# Altium schematic sheet Main.SchDoc
size A4; Revision: V1.0; SheetNumber: 1; SheetTotal: 3
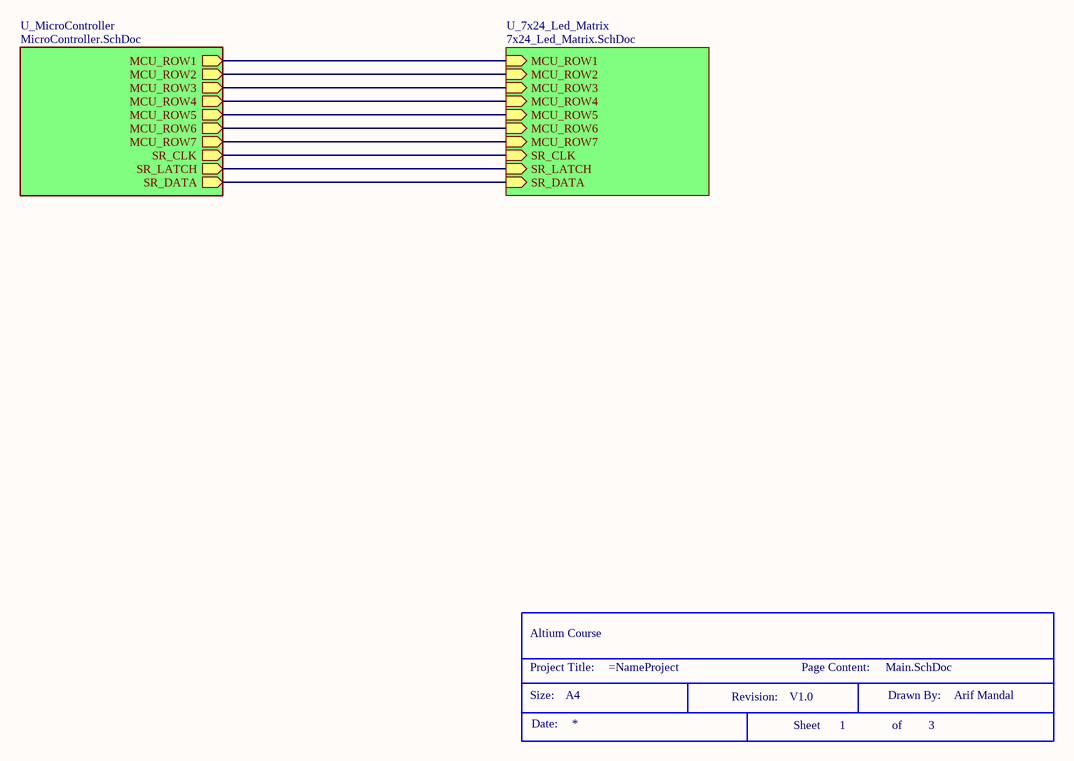
[diagram p0: Main.SchDoc]

## Parts
*  Size: A4  Drawn By: Arif Mandal  (hidden comment: Title Block)  (graphical)

## Sub-sheets
U_7x24_Led_Matrix = 7x24_Led_Matrix.SchDoc: MCU_ROW1 (in), MCU_ROW2 (in), MCU_ROW3 (in), MCU_ROW4 (in), MCU_ROW5 (in), MCU_ROW6 (in), MCU_ROW7 (in), SR_CLK (in), SR_LATCH (in), SR_DATA (in)
U_MicroController = MicroController.SchDoc: MCU_ROW1 (out), MCU_ROW2 (out), MCU_ROW3 (out), MCU_ROW4 (out), MCU_ROW5 (out), MCU_ROW6 (out), MCU_ROW7 (out), SR_CLK (out), SR_LATCH (out), SR_DATA (out)

## Nets
(unnamed): sheet U_MicroController/MCU_ROW1, sheet U_7x24_Led_Matrix/MCU_ROW1
(unnamed): sheet U_MicroController/MCU_ROW2, sheet U_7x24_Led_Matrix/MCU_ROW2
(unnamed): sheet U_MicroController/MCU_ROW3, sheet U_7x24_Led_Matrix/MCU_ROW3
(unnamed): sheet U_MicroController/MCU_ROW4, sheet U_7x24_Led_Matrix/MCU_ROW4
(unnamed): sheet U_MicroController/MCU_ROW5, sheet U_7x24_Led_Matrix/MCU_ROW5
(unnamed): sheet U_MicroController/MCU_ROW6, sheet U_7x24_Led_Matrix/MCU_ROW6
(unnamed): sheet U_MicroController/MCU_ROW7, sheet U_7x24_Led_Matrix/MCU_ROW7
(unnamed): sheet U_MicroController/SR_CLK, sheet U_7x24_Led_Matrix/SR_CLK
(unnamed): sheet U_MicroController/SR_LATCH, sheet U_7x24_Led_Matrix/SR_LATCH
(unnamed): sheet U_MicroController/SR_DATA, sheet U_7x24_Led_Matrix/SR_DATA

## Notes on the sheet
- (in symbol Title Block) Altium Course; Project Title:; Page Content:; Size:; Revision:; Drawn By:; Date:; Sheet; of